# EasyEDA schematic SCH_红外遥控_2021-12-05.json
TITLE: Sheet_1; REV: 1.0; Date: 2021-07-30; Sheet: 1/1; Drawn By: blooming1314; Company: Your Company
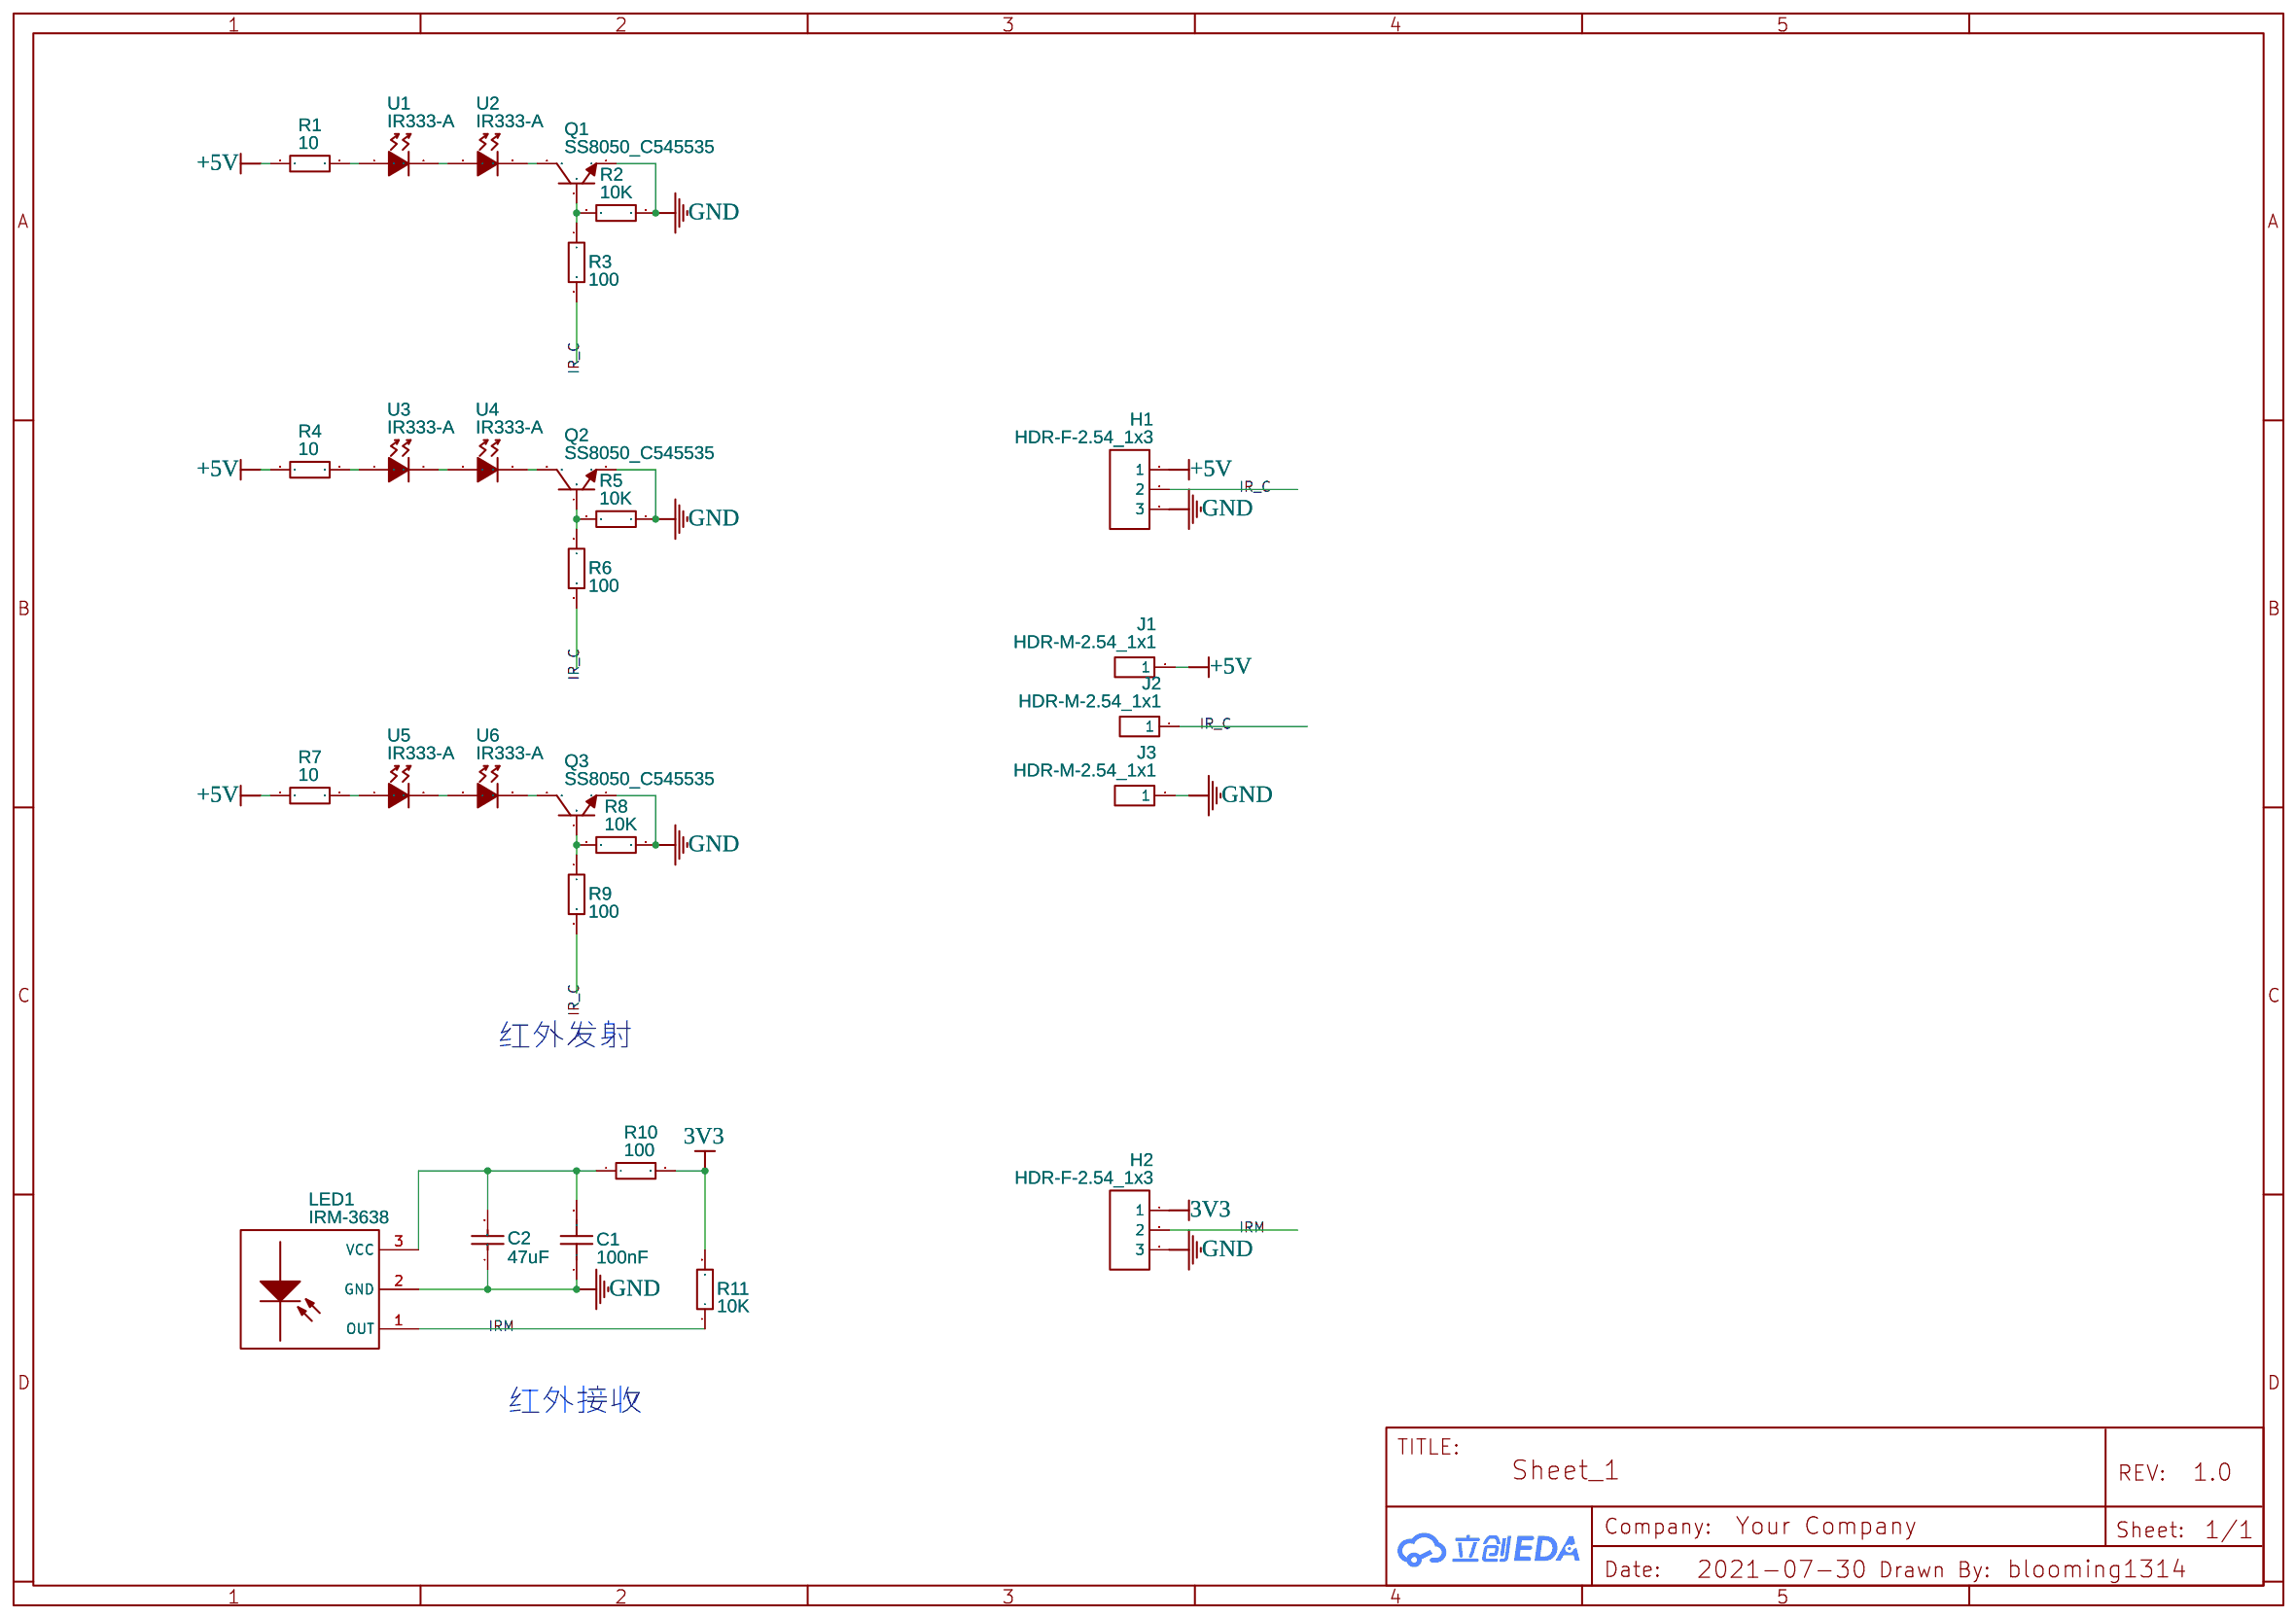
[diagram p0: schematic sheet]

## Parts
C1  100nF  [C0603]
C2  47uF  [C0603]
H1  HDR-F-2.54_1x3  [HDR-F-2.54_1X3]
H2  HDR-F-2.54_1x3  [HDR-F-2.54_1X3]
J1  HDR-M-2.54_1x1  [HDR-M-2.54_1X1]
J2  HDR-M-2.54_1x1  [HDR-M-2.54_1X1]
J3  HDR-M-2.54_1x1  [HDR-M-2.54_1X1]
LED1  IRM-3638  [OPTO-TH_IRM-3638T]
Q1  SS8050_C545535  [SOT-23-3_L2.9-W1.3-P1.90-LS2.4-BR]
Q2  SS8050_C545535  [SOT-23-3_L2.9-W1.3-P1.90-LS2.4-BR]
Q3  SS8050_C545535  [SOT-23-3_L2.9-W1.3-P1.90-LS2.4-BR]
R1  10  [R0603]
R2  10K  [R0603]
R3  100  [R0603]
R4  10  [R0603]
R5  10K  [R0603]
R6  100  [R0603]
R7  10  [R0603]
R8  10K  [R0603]
R9  100  [R0603]
R10  100  [R0603]
R11  10K  [R0603]
U1  IR333-A  [LED-TH_BD6.2-P2.54-FD]
U2  IR333-A  [LED-TH_BD6.2-P2.54-FD]
U3  IR333-A  [LED-TH_BD6.2-P2.54-FD]
U4  IR333-A  [LED-TH_BD6.2-P2.54-FD]
U5  IR333-A  [LED-TH_BD6.2-P2.54-FD]
U6  IR333-A  [LED-TH_BD6.2-P2.54-FD]

## Library data of the parts
C1 = CC0603KRX7R7BB104: Supplier: LCSC; Supplier Part: C108079; Manufacturer: YAGEO; Contributor: LCSC; JLCPCB Part Class: Extended Part
C2 = GRM188R60J476ME15D: Supplier: LCSC; Manufacturer: MuRata; Contributor: LCSC; Supplier Part: C140782; JLCPCB Part Class: Extended Part
H1 H2 = HDR-F-2.54_1x3: Supplier Part: C146690; Supplier: LCSC; Contributor: LCEDA_Lib
J1-J3 = HDR-M-2.54_1x1: Supplier Part: C81276; Supplier: LCSC; Contributor: LCEDA_Lib
LED1 = IRM-3638: Supplier: LCSC; Supplier Part: C131209; Manufacturer: Everlight Elec; Contributor: LCSC; JLCPCB Part Class: Extended Part
Q1-Q3 = SS8050_C545535: Supplier: LCSC; Supplier Part: C545535; Manufacturer: UMW(Youtai Semiconductor Co., Ltd.); Manufacturer Part: SS8050; Contributor: LCSC; JLCPCB Part Class: Extended Part
R1 R4 R7 = AECR0603F10R0K9: Supplier: LCSC; Supplier Part: C328336; Manufacturer: ResistorToday; Contributor: LCSC
R2 R5 R8 = 0603WAF1002T5E: Supplier: LCSC; Manufacturer: UniOhm; Supplier Part: C25804; SMT Type: Basic; JLCPCB SMD: Yes
R3 R6 R9 R10 = 0603WAJ0101T5E: Supplier: LCSC; Manufacturer: UniOhm; Supplier Part: C25201; JLCPCB Part Class: Extended Part
R11 = 0603WAF1002T5E: Supplier: LCSC; Manufacturer: UniOhm; Supplier Part: C25804; JLCPCB Part Class: Basic Part
U1-U6 = IR333-A: Supplier: LCSC; Supplier Part: C95407; Manufacturer: Everlight Elec; Contributor: LCSC; JLCPCB Part Class: Extended Part

## Nets
3V3: H2.1 R10.2 R11.2
+5V: H1.1 J1.1 R1.2 R4.2 R7.2
GND: C1.1 C2.1 H1.3 H2.3 J3.1 LED1.2(GND) Q1.2(E) Q2.2(E) Q3.2(E) R2.1 R5.1 R8.1
IR_C: H1.2 J2.1 R3.2 R6.2 R9.2
IRM: H2.2 LED1.1(OUT) R11.1
Net-(C1-2): C1.2 C2.2 LED1.3(VCC) R10.1
Net-(Q1-1): Q1.1(B) R2.2 R3.1
Net-(Q1-3): Q1.3(C) U2.2(C)
Net-(Q2-1): Q2.1(B) R5.2 R6.1
Net-(Q2-3): Q2.3(C) U4.2(C)
Net-(Q3-1): Q3.1(B) R8.2 R9.1
Net-(Q3-3): Q3.3(C) U6.2(C)
Net-(R1-1): R1.1 U1.1(A)
Net-(R4-1): R4.1 U3.1(A)
Net-(R7-1): R7.1 U5.1(A)
Net-(U1-2): U1.2(C) U2.1(A)
Net-(U3-2): U3.2(C) U4.1(A)
Net-(U5-2): U5.2(C) U6.1(A)

## Notes on the sheet
- 红外发射
- 红外接收
